# Altium schematic sheet main.SchDoc
size A4
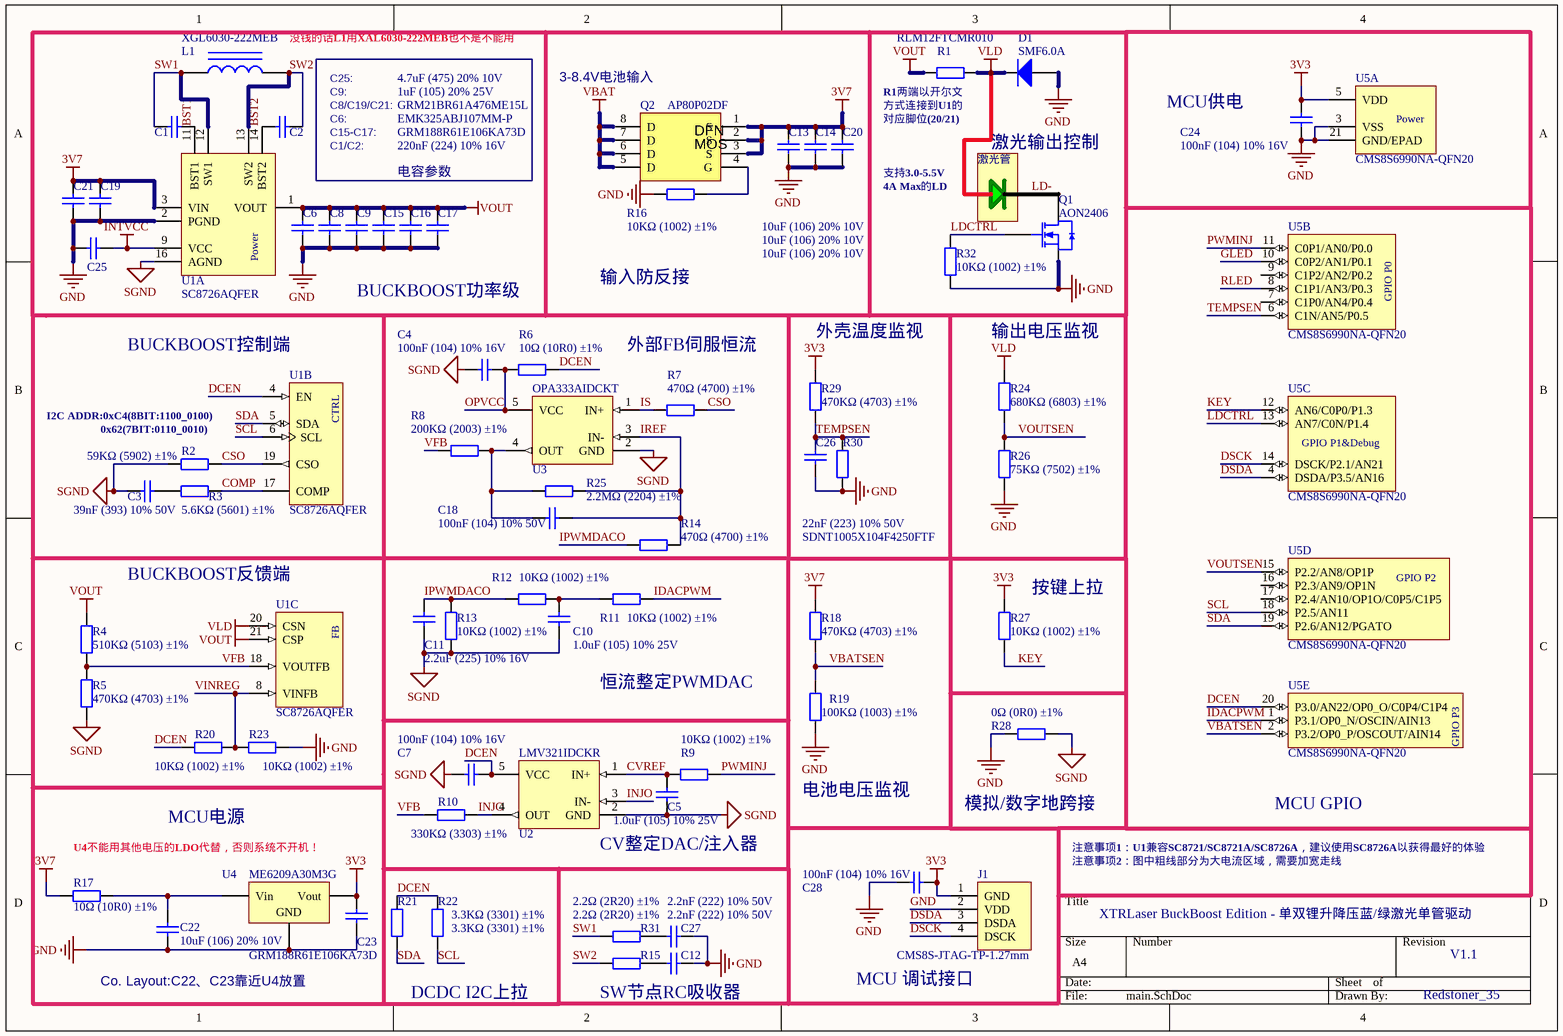
[diagram p0: main.SchDoc]

## Parts
C1  220nF (224) 10% 16V  [0402_C]  (value not drawn)
C2  220nF (224) 10% 16V  [0402_C]
C3  39nF (393) 10% 50V  [0402_C]
C4  100nF (104) 10% 16V  [0402_C]
C5  1.0uF (105) 10% 25V  [0402_C]
C6  EMK325ABJ107MM-P  [1210C]
C7  100nF (104) 10% 16V  [0402_C]
C8  GRM21BR61A476ME15L  [0805_C]  (value not drawn)
C9  1uF (105) 20% 25V  [0402_C]
C10  1.0uF (105) 10% 25V  [0402_C]
C11  2.2uF (225) 10% 16V  [0402_C]
C12  2.2nF (222) 10% 50V  [0402_C]
C13  10uF (106) 20% 10V  [0402_C]
C14  10uF (106) 20% 10V  [0402_C]
C15  GRM188R61E106KA73D  [0603_C]
C16  GRM188R61E106KA73D  [0603_C]  (value not drawn)
C17  GRM188R61E106KA73D  [0603_C]  (value not drawn)
C18  100nF (104) 10% 50V  [0402_C]
C19  GRM21BR61A476ME15L  [0805_C]
C20  10uF (106) 20% 10V  [0402_C]
C21  GRM21BR61A476ME15L  [0805_C]  (value not drawn)
C22  10uF (106) 20% 10V  [0402_C]
C23  GRM188R61E106KA73D  [0603_C]
C24  100nF (104) 10% 16V  [0402_C]
C25  4.7uF (475) 20% 10V  [0402_C]
C26  22nF (223) 10% 50V  [0402_C]
C27  2.2nF (222) 10% 50V  [0402_C]
C28  100nF (104) 10% 16V  [0402_C]
D1  SMF6.0A  [SOD-123]
J1  CMS8S-JTAG-TP-1.27mm  [CMS8S-JTAG-TP-2x2-P1.27]
L1  XGL6030-222MEB  [XAL6030-xxxME]
Q1  AON2406  [PDFN-6_L2.0-W2.0-P0.65-BL-EP]
Q2  AP80P02DF  [DFN-8_L3.0-W3.0-P0.65-BL]
R1  RLM12FTCMR010  [1206_R]
R2  59KΩ (5902) ±1%  [0402_R]
R3  5.6KΩ (5601) ±1%  [0402_R]
R4  510KΩ (5103) ±1%  [0402_R]
R5  470KΩ (4703) ±1%  [0402_R]
R6  10Ω (10R0) ±1%  [0402_R]
R7  470Ω (4700) ±1%  [0402_R]
R8  200KΩ (2003) ±1%  [0402_R]
R9  10KΩ (1002) ±1%  [0402_R]
R10  330KΩ (3303) ±1%  [0402_R]
R11  10KΩ (1002) ±1%  [0402_R]
R12  10KΩ (1002) ±1%  [0402_R]
R13  10KΩ (1002) ±1%  [0402_R]
R14  470Ω (4700) ±1%  [0402_R]
R15  2.2Ω (2R20) ±1%  [0402_R]
R16  10KΩ (1002) ±1%  [0402_R]
R17  10Ω (10R0) ±1%  [0402_R]
R18  470KΩ (4703) ±1%  [0402_R]
R19  100KΩ (1003) ±1%  [0402_R]
R20  10KΩ (1002) ±1%  [0402_R]
R21  3.3KΩ (3301) ±1%  [0402_R]
R22  3.3KΩ (3301) ±1%  [0402_R]
R23  10KΩ (1002) ±1%  [0402_R]
R24  680KΩ (6803) ±1%  [0402_R]
R25  2.2MΩ (2204) ±1%  [0402_R]
R26  75KΩ (7502) ±1%  [0402_R]
R27  10KΩ (1002) ±1%  [0402_R]
R28  0Ω (0R0) ±1%  [0402_R]
R29  470KΩ (4703) ±1%  [0402_R]
R30  SDNT1005X104F4250FTF  [0402_R]
R31  2.2Ω (2R20) ±1%  [0402_R]
R32  10KΩ (1002) ±1%  [0402_R]
U1  SC8726AQFER  [VQFN-21(4x4x0.75)]  (parts A,B,C of 3)
U2  LMV321IDCKR  [SC70-5]
U3  OPA333AIDCKT  [SC70-5]
U4  ME6209A30M3G  [SOT-23-3L]
U5  CMS8S6990NA-QFN20  [QFN40P300X300X800_HS-21N]  (parts A,B,C,D,E of 5)

## Nets
3V3: C23.2 C24.2 C28.1 J1.1(GND) R27.2 R29.2 U4.2(Vout) U5.5(VDD)
3V7: C13.2 C14.2 C19.2 C20.2 C21.2 Q2.1(S) Q2.2(S) Q2.3(S) R17.1 R18.2 U1.3(VIN)
GND: C6.1 C8.1 C9.2 C12.2 C13.1 C14.1 C15.1 C16.1 C17.1 C19.1 C20.1 C21.1 C22.1 C23.1 C24.1 C25.1 C26.1 C27.1 C28.2 D1.1(A) J1.2(VDD) Q1.2(S) R16.1 R19.1 R23.1 R26.1 R28.2 R30.1 R32.1 U1.2(PGND) U4.1(GND) U5.3(VSS) U5.21(GND/EPAD)
INTVCC: C25.2 U1.9(VCC)
SGND: C3.1 C4.1 C5.1 C7.1 C10.2 C11.1 R2.1 R5.1 R13.1 R28.1 U1.16(AGND) U2.2(GND) U3.2(GND)
VBAT: Q2.5(D) Q2.6(D) Q2.7(D) Q2.8(D)
VLD: D1.2(K) R1.2 R24.2 U1.20(CSN)
VOUT: C6.2 C8.2 C9.1 C15.2 C16.2 C17.2 R1.1 R4.2 U1.1(VOUT) U1.21(CSP)
BST1: C1.2 U1.11(BST1)
BST2: C2.1 U1.14(BST2)
COMP: R3.2 U1.17(COMP)
CSO: R2.2 R7.2 U1.19(CSO)
CVREF: C5.2 R9.1 U2.1(IN+)
DCEN: C7.2 R6.2 R20.2 R21.1 R22.1 U1.4(EN) U2.5(VCC) U5.20(P3.0/AN22/OP0_O/C0P4/C1P4)
DSCK: J1.4(DSCK) U5.14(DSCK/P2.1/AN21)
DSDA: J1.3(DSDA) U5.4(DSDA/P3.5/AN16)
GLED: U5.10(C0P2/AN1/P0.1)
IDACPWM: R11.2 U5.1(P3.1/OP0_N/OSCIN/AIN13)
INJO: R10.2 U2.3(IN-) U2.4(OUT)
IPWMDACO: C11.2 R12.1 R13.2 R14.2
IREF: C18.1 R14.1 R25.1 U3.3(IN-)
IS: R7.1 U3.1(IN+)
KEY: R27.1 U5.12(AN6/C0P0/P1.3)
LD-: Q1.3(D)
LDCTRL: Q1.1(G) R32.2 U5.13(AN7/C0N/P1.4)
OPVCC: C4.2 R6.1 U3.5(VCC)
PWMINJ: R9.2 U5.11(C0P1/AN0/P0.0)
RLED: U5.8(C1P1/AN3/P0.3)
SCL: R22.2 U1.6(SCL) U5.18(P2.5/AN11)
SDA: R21.2 U1.5(SDA) U5.19(P2.6/AN12/PGATO)
SW1: C1.1 L1.1 R31.2 U1.12(SW1)
SW2: C2.2 L1.2 R15.1 U1.13(SW2)
TEMPSEN: C26.2 R29.1 R30.2 U5.6(C1N/AN5/P0.5)
VBATSEN: R18.1 R19.2 U5.2(P3.2/OP0_P/OSCOUT/AIN14)
VFB: R4.1 R5.2 R8.1 R10.1 U1.18(VOUTFB)
VINREG: R20.1 R23.2 U1.8(VINFB)
VOUTSEN: R24.1 R26.2 U5.15(P2.2/AN8/OP1P)
NetC3_2: C3.2 R3.1
NetC10_1: C10.1 R11.1 R12.2
NetC12_1: C12.1 R15.2
NetC18_2: C18.2 R8.2 R25.2 U3.4(OUT)
NetC22_2: C22.2 R17.2 U4.3(Vin)
NetC27_2: C27.2 R31.1
NetQ2_4: Q2.4(G) R16.2

Not connected (* = marked no-connect by the designer): U5 7(C1P0/AN4/P0.4) 9(C1P2/AN2/P0.2) 16(P2.3/AN9/OP1N) 17(P2.4/AN10/OP1O/C0P5/C1P5)

## Notes on the sheet
- (near L1) 没钱的话L1用XAL6030-222MEB也不是不能用
- C8/C19/C21:
- C9:
- C25:
- (near Q2) 3-8.4V电池输入
- (near R1) R1两端以开尔文
- 方式连接到U1的
- MCU供电
- C6:
- C15-C17:
- C1/C2:
- 电容参数
- 对应脚位(20/21)
- 支持3.0-5.5V
- 激光管
- 激光输出控制
- 4A Max的LD
- BUCKBOOST功率级
- 输入防反接
- BUCKBOOST控制端
- 外部FB伺服恒流
- (near R29) 外壳温度监视
- 输出电压监视
- (near R2) I2C ADDR:0xC4(8BIT:1100_0100)
- (near R2) 0x62(7BIT:0110_0010)
- BUCKBOOST反馈端
- (near R27) 按键上拉
- 恒流整定PWMDAC
- U4不能用其他电压的LDO代替，否则系统不开机！
- MCU电源
- CV整定DAC/注入器
- 电池电压监视
- 模拟/数字地跨接
- 注意事项1：U1兼容SC8721/SC8721A/SC8726A，建议使用SC8726A以获得最好的体验
- MCU GPIO
- 注意事项2：图中粗线部分为大电流区域，需要加宽走线
- XTRLaser BuckBoost Edition - 单双锂升降压蓝/绿激光单管驱动
- Co. Layout:C22、C23靠近U4放置
- MCU 调试接口
- V1.1
- DCDC I2C上拉
- SW节点RC吸收器
- Redstoner_35
- (in symbol CM8S6990NA-QFN20, part A) Power
- (in symbol CM8S6990NA-QFN20, part B) GPIO P0
- (in symbol CM8S6990NA-QFN20, part C) GPIO P1&Debug
- (in symbol CM8S6990NA-QFN20, part D) GPIO P2
- (in symbol CM8S6990NA-QFN20, part E) GPIO P3
- (in symbol SC8721QFER, part A) Power
- (in symbol SC8721QFER, part B) CTRL
- (in symbol SC8721QFER, part C) FB
- (in symbol SON/DFN5x6 MOS) DFN; MOS

## Library data of the parts
C1 C2 C4 C7 C24 C28 = 0402 100nF (104) 10% 16V: 贴片电容; ComponentLink1Description: 供应商链接; ComponentLink1URL: http://www.szlcsc.com/product/details_1877.html; Package: 0402; Supplier: LC; SuppliersPartNumber: C1525
C3 = 0402 22nF (223) 10% 50V: 贴片电容; ComponentLink1Description: 供应商链接; ComponentLink1URL: http://www.szlcsc.com/product/details_1884.html; Package: 0402; Supplier: LC; SuppliersPartNumber: C1532
C5 C10 = 0402 1.0uF (105) 10% 25V: 贴片电容; ComponentLink1Description: 供应商链接; ComponentLink1URL: http://www.szlcsc.com/product/details_53938.html; Package: 0402; Supplier: LC; SuppliersPartNumber: C52923
C6 = Cap: MLCC电容 10V 100uF±20% 16V X5R; Value: 100uF; Published: 8-Jun-2000; LatestRevisionDate: 17-Jul-2002; LatestRevisionNote: Re-released for DXP Platform.; PackageReference: RAD-0.3; Publisher: Altium Limited; PackageDescription: Radial Cap, Thru-Hole; 2 Leads; 0.3 in Pin Spacing
C8 C19 C21 = 0805 22uF (226) 20% 25V: 贴片MLCC电容，47uF ±20% 10V X5R; ComponentLink1Description: 供应商链接; ComponentLink1URL: http://www.szlcsc.com/product/details_46786.html; Package: 0805; Supplier: LC; SuppliersPartNumber: C45783
C9 C25 = 0402 4.7uF (475) 20% 10V: 贴片电容; ComponentLink1Description: 供应商链接; ComponentLink1URL: http://www.szlcsc.com/product/details_24469.html; Package: 0402; Supplier: LC; SuppliersPartNumber: C23733
C11 C12 C27 = 0402 2.2nF (222) 10% 50V: 贴片电容; ComponentLink1Description: 供应商链接; ComponentLink1URL: http://www.szlcsc.com/product/details_1883.html; Package: 0402; Supplier: LC; SuppliersPartNumber: C1531
C13 C14 C20 C22 = 0402 10uF (106) 20% 6.3V: 贴片电容; ComponentLink1Description: 供应商链接; ComponentLink1URL: http://www.szlcsc.com/product/details_16204.html; Package: 0402; Supplier: LC; SuppliersPartNumber: C15525
C15-C17 = 0603 10uF (106) 10% 10V: 贴片MLCC电容 10uF±20% 10V X5R; ComponentLink1Description: 供应商链接; ComponentLink1URL: http://www.szlcsc.com/product/details_20411.html; Package: 0603; Supplier: LC; SuppliersPartNumber: C19702
C18 C26 = 0402 10nF (103) 10% 50V: 贴片电容; ComponentLink1Description: 供应商链接; ComponentLink1URL: http://www.szlcsc.com/product/details_15869.html; Package: 0402; Supplier: LC; SuppliersPartNumber: C15195
C23 = 0603 10uF (106) 10% 10V: 贴片电容; ComponentLink1Description: 供应商链接; ComponentLink1URL: http://www.szlcsc.com/product/details_20411.html; Package: 0603; Supplier: LC; SuppliersPartNumber: C19702
D1 = SOD-123 B5819W  SL: TVS二极管 6V持续工作电压; ComponentLink1Description: 供应商链接; ComponentLink1URL: http://www.szlcsc.com/product/details_9093.html; Package: SOD-123; Supplier: LC; SuppliersPartNumber: C8598
J1 = CMS8S-JTAG-TP-1.27mm: 面向CMS8S6990NA单片机的调试贴片触点，并不是元器件实物
L1 = Inductor Iron: 线艺XGL系列低损耗一体成型低内阻电感 2.2uH ±20% 8.7mΩ DCR 12A饱和电流; Value: 1.8uH; Published: 24-Mar-1999; LatestRevisionDate: 17-Jul-2002; LatestRevisionNote: Re-released for DXP Platform.; PackageReference: AXIAL-0.9; Publisher: Altium Limited; PackageDescription: Axial Device, Thru-Hole; 2 Leads; 0.9 in Pin Spacing
Q1 = AO3400A N道沟 X0YV1T SOT-23: MOS(场效应管); pin to pad: 1>G 2>S 3>D; ComponentLink1Description: 供应商链接; ComponentLink1URL: http://www.szlcsc.com/product/details_21629.html; Package: SOT-23; Supplier: LC; SuppliersPartNumber: C20917
Q2 = SON/DFN5x6 MOS: PDFN3x3 -20V 50A P沟道MOSFET 4.0mΩ @ -2.5V
R1 = 1206 0.1Ω (R100) 1%: 0.01Ω (R010) ±1% 1W 合金电流检测电阻; ComponentLink1Description: 供应商链接; ComponentLink1URL: http://www.szlcsc.com/product/details_26077.html; Package: 1206; Supplier: LC; SuppliersPartNumber: C25334
R2 = 0402 56KΩ (5602) 1%: 贴片电阻; ComponentLink1Description: 供应商链接; ComponentLink1URL: http://www.szlcsc.com/product/details_26539.html; Package: 0402; Supplier: LC; SuppliersPartNumber: C25796
R3 R9 R11-R13 R16 R20 R23 R27 R32 = 0402 10KΩ (1002) 1%: 贴片电阻; ComponentLink1Description: 供应商链接; ComponentLink1URL: http://www.szlcsc.com/product/details_26487.html; Package: 0402; Supplier: LC; SuppliersPartNumber: C25744
R4 R5 R8 R19 = 0402 100KΩ (1003) 1%: 贴片电阻; ComponentLink1Description: 供应商链接; ComponentLink1URL: http://www.szlcsc.com/product/details_26484.html; Package: 0402; Supplier: LC; SuppliersPartNumber: C25741
R6 = 0402 10Ω (10R0) 1%: 贴片电阻; ComponentLink1Description: 供应商链接; ComponentLink1URL: http://www.szlcsc.com/product/details_25820.html; Package: 0402; Supplier: LC; SuppliersPartNumber: C25077
R7 R14 = 0402 470Ω (4700) 1%: 贴片电阻; ComponentLink1Description: 供应商链接; ComponentLink1URL: http://www.szlcsc.com/product/details_25860.html; Package: 0402; Supplier: LC; SuppliersPartNumber: C25117
R10 = 0402 330KΩ (3303) 1%: 贴片电阻; ComponentLink1Description: 供应商链接; ComponentLink1URL: http://www.szlcsc.com/product/details_26521.html; Package: 0402; Supplier: LC; SuppliersPartNumber: C25778
R15 R31 = 0402 1Ω (1R00) 1%: 贴片电阻; ComponentLink1Description: 供应商链接; ComponentLink1URL: http://www.szlcsc.com/product/details_25829.html; Package: 0402; Supplier: LC; SuppliersPartNumber: C25086
R17 = 0402 22Ω (22R0) 1%: 贴片电阻; ComponentLink1Description: 供应商链接; ComponentLink1URL: http://www.szlcsc.com/product/details_25835.html; Package: 0402; Supplier: LC; SuppliersPartNumber: C25092
R18 R24 R29 = 0402 470KΩ (4703) 1%: 贴片电阻; ComponentLink1Description: 供应商链接; ComponentLink1URL: http://www.szlcsc.com/product/details_26533.html; Package: 0402; Supplier: LC; SuppliersPartNumber: C25790
R21 R22 = 0402 3.3KΩ (3301) 1%: 贴片电阻; ComponentLink1Description: 供应商链接; ComponentLink1URL: http://www.szlcsc.com/product/details_26633.html; Package: 0402; Supplier: LC; SuppliersPartNumber: C25890
R25 = 0402 1MΩ (1004) 1%: 贴片电阻; ComponentLink1Description: 供应商链接; ComponentLink1URL: http://www.szlcsc.com/product/details_26826.html; Package: 0402; Supplier: LC; SuppliersPartNumber: C26083
R26 = 0402 68KΩ (6802) 1%: 贴片电阻; ComponentLink1Description: 供应商链接; ComponentLink1URL: http://www.szlcsc.com/product/details_37849.html; Package: 0402; Supplier: LC; SuppliersPartNumber: C36871
R28 = 0402 0Ω (0R0) 1%: 贴片电阻; ComponentLink1Description: 供应商链接; ComponentLink1URL: http://www.szlcsc.com/product/details_17853.html; Package: 0402; Supplier: LC; SuppliersPartNumber: C17168
R30 = 0402 200KΩ (2003) 1%: 贴片热敏电阻0402 B4250 100K ±1%; ComponentLink1Description: 供应商链接; ComponentLink1URL: http://www.szlcsc.com/product/details_26507.html; Package: 0402; Supplier: LC; SuppliersPartNumber: C25764
U1 = SC8721QFER: 同步单片集成式双向四开关单芯片集成升降压转换器，内置MOSFET，2.7-22V输入范围，2.4-22V输出范围，支持I2C控制
U2 = LMV321IDCKR: CMOS超小型运算放大器，SC70-5
U3 = LMV321IDCKR: CMOS超小型0漂移运算放大器，SC70-5封装，350KHz GBW
U4 = SOT-23 XC6206P332MR: 低压差线性稳压(LDO)，输入耐压18V 输出3V 300mA最大电流 SOT23-3封装; ComponentLink1Description: 供应商链接; ComponentLink1URL: http://www.szlcsc.com/product/details_5896.html; Package: SOT-23; Supplier: LC; SuppliersPartNumber: C5446
U5 = CM8S6990NA-QFN20: 增强型闪存1T 8051单片机，16KB Flash 256+1K XRAM